# EAGLE design legoPFremote (EAGLE 8.3.2)
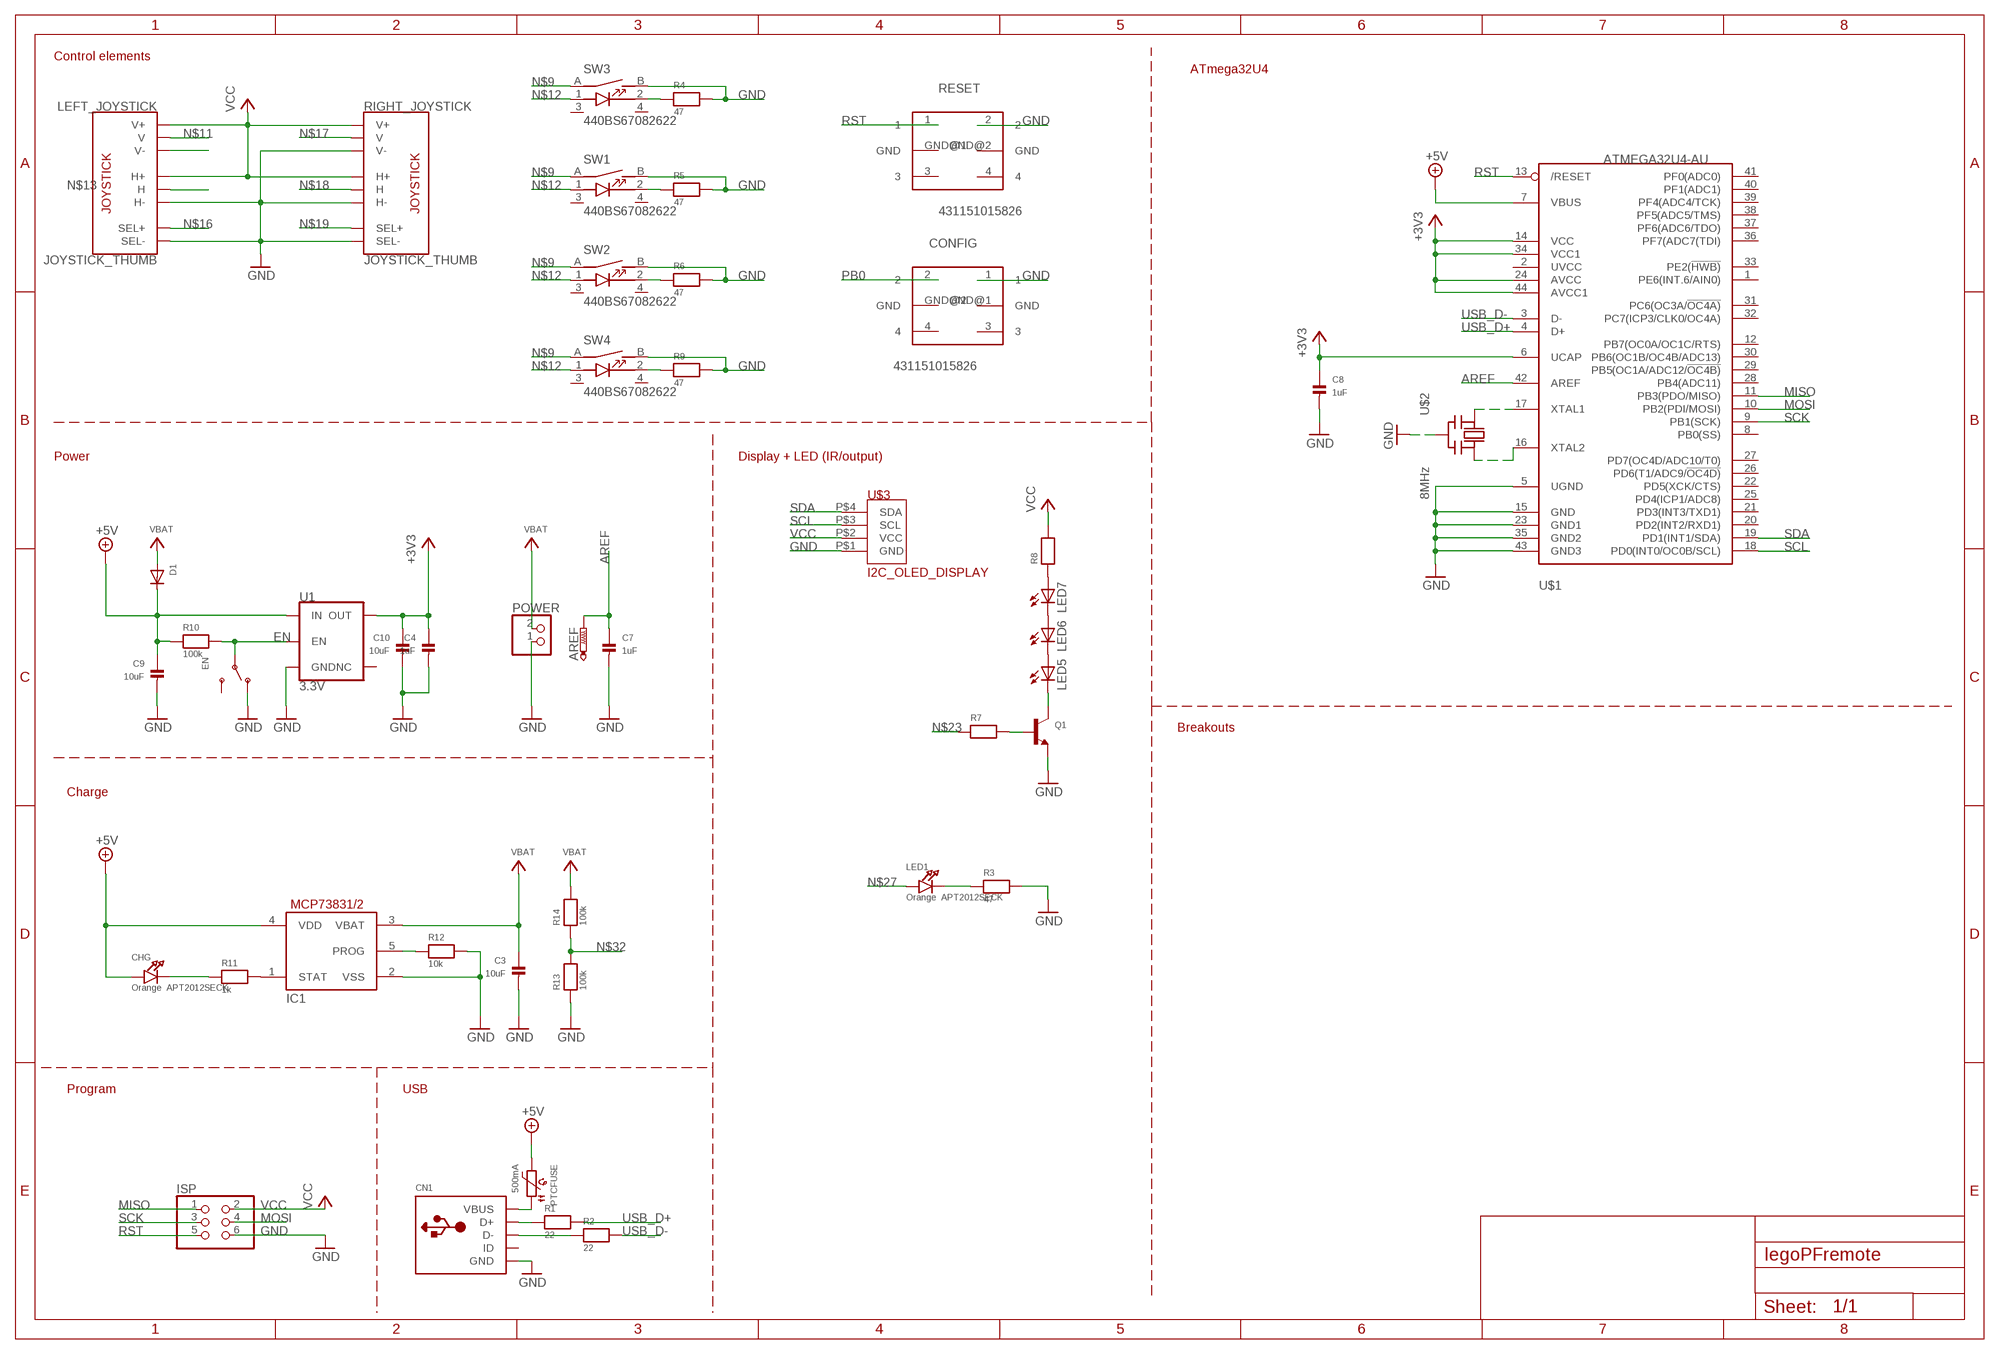
[diagram p0: schematic, sheet 1]

## Parts
AREF  PTR1B1,27  [B1,27]
C3  10uF  CAP_CERAMIC0805  [0805]
C4  1uF  CAP_CERAMIC0805  [0805]
C7  1uF  CAP_CERAMIC0805  [0805]
C8  1uF  CAP_CERAMIC0805  [0805]
C9  10uF  CAP_CERAMIC0805  [0805]
C10  10uF  CAP_CERAMIC0805  [0805]
CHG  Orange APT2012SECK  LED0805  [CHIPLED_0805]
CN1  USBMINIB  [USB-MINIB]
CONFIG  431151015826  [431181015816]
D1  DIODESOD-123  [SOD-123]
EN  SWITCH_SPDT  [SPDT_SMT_SSSS811101]
IC1  MCP73831/OT  [SOT23-5L]
ISP  PINHD-2X3  [2X03]
LED1  Orange APT2012SECK  LED0805  [CHIPLED_0805]
LED5  LEDIRL80A  [IRL80A]
LED6  LEDIRL80A  [IRL80A]
LED7  LEDIRL80A  [IRL80A]
LEFT_JOYSTICK  JOYSTICK_THUMB  [JOYSTICK]
POWER  JST_2PIN-THM  [JST-PH-2-THM]
PTCFUSE  500mA  PTC1206  [1206]
Q1  TRANSISTOR_NPN  [SOT23-R]
R1  22  RESISTOR0805  [0805]
R2  22  RESISTOR0805  [0805]
R3  47  RESISTOR0805  [0805]
R4  47  RESISTOR0805  [0805]
R5  47  RESISTOR0805  [0805]
R6  47  RESISTOR0805  [0805]
R7  RESISTOR0805  [0805]
R8  RESISTOR0805  [0805]
R9  47  RESISTOR0805  [0805]
R10  100k  RESISTOR0805  [0805]
R11  1k  RESISTOR0805  [0805]
R12  10k  RESISTOR0805  [0805]
R13  100k  RESISTOR0805  [0805]
R14  100k  RESISTOR0805  [0805]
RESET  431151015826  [431181015816]
RIGHT_JOYSTICK  JOYSTICK_THUMB  [JOYSTICK]
SW1  440BS67082622  [440BS67082622]
SW2  440BS67082622  [440BS67082622]
SW3  440BS67082622  [440BS67082622]
SW4  440BS67082622  [440BS67082622]
U1  3.3V  V_REG_AP2112K-3.3V  [SOT23-5]
U$1  ATMEGA32U4-AU  [TQFP44]
U$2  8MHz  CERMOSCILL-CSTCRG  [CSTCR-G]
U$3  I2C_OLED_DISPLAY  [HD1X4]

## Nets
+3V3: C4.1 C8.1 C10.1 U1.5(OUT) U$1.6(UCAP) U$1.14(VCC) U$1.24(AVCC) U$1.34(VCC1) U$1.44(AVCC1)
+5V: C9.1 CHG.A D1.C IC1.4(VDD) PTCFUSE.2 R10.1 U1.1(IN) U$1.7(VBUS)
AREF: AREF.TP C7.1 U$1.42(AREF)
EN: EN.B(P) R10.2 U1.3(EN)
GND: C3.2 C4.2 C7.2 C8.2 C9.2 C10.2 CN1.GND CONFIG.1 EN.A(O) IC1.2(VSS) ISP.6 LEFT_JOYSTICK.B2A(SEL-) LEFT_JOYSTICK.H3(H-) POWER.1 Q1.2(E) R3.2 R4.2 R5.2 R6.2 R9.2 R12.2 R13.1 RESET.2 RIGHT_JOYSTICK.B2A(SEL-) RIGHT_JOYSTICK.H3(H-) RIGHT_JOYSTICK.V3(V-) SW1.B SW2.B SW3.B SW4.B U1.2(GND) U$1.5(UGND) U$1.15(GND) U$1.23(GND1) U$1.35(GND2) U$1.43(GND3) U$2.2(GND) U$3.P$1(GND)
MISO: ISP.1 U$1.11(PB3(PDO/MISO))
MOSI: ISP.4 U$1.10(PB2(PDI/MOSI))
N$1: CN1.D+ R1.1
N$2: CN1.D- R2.1
N$3: LED5.A LED6.K(C)
N$4: LED6.A LED7.K(C)
N$5: CN1.VBUS PTCFUSE.1
N$6: U$1.16(XTAL2) U$2.3(OUT)
N$7: U$1.17(XTAL1) U$2.1(IN)
N$8: LED1.C R3.1
N$9: SW1.A SW2.A SW3.A SW4.A
N$10: R4.1 SW3.2
N$11: LEFT_JOYSTICK.V2(V)
N$12: SW1.1 SW2.1 SW3.1 SW4.1
N$13: LEFT_JOYSTICK.H2(H)
N$14: R5.1 SW1.2
N$15: R6.1 SW2.2
N$16: LEFT_JOYSTICK.B1A(SEL+)
N$17: RIGHT_JOYSTICK.V2(V)
N$18: RIGHT_JOYSTICK.H2(H)
N$19: RIGHT_JOYSTICK.B1A(SEL+)
N$20: Q1.1(B) R7.2
N$21: LED7.A R8.1
N$22: LEFT_JOYSTICK.V3(V-)
N$23: R7.1
N$24: LED5.K(C) Q1.3(C)
N$25: R9.1 SW4.2
N$26: IC1.1(STAT) R11.2
N$27: LED1.A
N$28: CHG.C R11.1
N$30: IC1.5(PROG) R12.1
N$32: R13.2 R14.1
PB0: CONFIG.2
RST: ISP.5 RESET.1 U$1.13(/RESET)
SCK: ISP.3 U$1.9(PB1(SCK))
SCL: U$1.18(PD0(INT0/OC0B/SCL)) U$3.P$3(SCL)
SDA: U$1.19(PD1(INT1/SDA)) U$3.P$4(SDA)
USB_D+: R1.2 U$1.4(D+)
USB_D-: R2.2 U$1.3(D-)
VBAT: C3.1 D1.A IC1.3(VBAT) POWER.2 R14.2
VCC: ISP.2 LEFT_JOYSTICK.H1(H+) LEFT_JOYSTICK.V1(V+) R8.2 RIGHT_JOYSTICK.H1(H+) RIGHT_JOYSTICK.V1(V+) U$3.P$2(VCC)
Unconnected: CN1.ID CONFIG.3 CONFIG.4 CONFIG.GND@1(GND) CONFIG.GND@2(GND) EN.C(S) RESET.3 RESET.4 RESET.GND@1(GND) RESET.GND@2(GND) SW1.3 SW1.4 SW2.3 SW2.4 SW3.3 SW3.4 SW4.3 SW4.4 U1.4(NC) U$1.1(PE6(INT.6/AIN0)) U$1.2(UVCC) U$1.8(PB0(SS)) U$1.12(PB7(OC0A/OC1C/RTS)) U$1.20(PD2(INT2/RXD1)) U$1.21(PD3(INT3/TXD1)) U$1.22(PD5(XCK/CTS)) U$1.25(PD4(ICP1/ADC8)) U$1.26(PD6(T1/ADC9/!OC4D)) U$1.27(PD7(OC4D/ADC10/T0)) U$1.28(PB4(ADC11)) U$1.29(PB5(OC1A/ADC12/!OC4B)) U$1.30(PB6(OC1B/OC4B/ADC13)) U$1.31(PC6(OC3A/!OC4A)) U$1.32(PC7(ICP3/CLK0/OC4A)) U$1.33(PE2(!HWB)) U$1.36(PF7(ADC7(TDI)) U$1.37(PF6(ADC6/TDO)) U$1.38(PF5(ADC5/TMS)) U$1.39(PF4(ADC4/TCK)) U$1.40(PF1(ADC1)) U$1.41(PF0(ADC0))

## Notes on the sheet
- Control elements
- ATmega32U4
- Power | Display + LED (IR/output)
- Breakouts
- Charge
- Program | USB

## Library data of the parts
AREF = testpad:PTR1: TEST PIN
C3 C4 C7-C10 = microbuilder:CAP_CERAMIC: Ceramic Capacitors 0402 - 0402 Surface Mount Capacitors 16pF 50V 5% [Digikey: 445-4899-2-ND] 18pF 50V 5% [Digikey: 490-1281-2-ND] 22pF 50V 5% [Digikey: 490-1283-2-ND] 68pF 50V 5% [Digikey: 490-1289-2-ND] 0.1uF 10V 10% [Digikey: 490-1318-2-ND] 1.0uF 6.3V 10% [Digikey: 490-1320-2-ND] 0603 - 0603 Surface Mount Capacitors 16 pF 50V 5% [Digikey: 445-5051-2-ND] 22 pF 50V [Digikey: PCC220ACVTR-ND] 33 pF 50V 5% [Digikey: 490-1415-1-ND] 56pF 50V 5% [Digikey: 490-1421-1-ND] 220pF 50V 5% [Digikey: 445-1285-1-ND] 680 pF 50V 2200 pF 50V 5% C0G [Digikey: 445-1297-1-ND] 5600 pF 100V 5% X7R [Digikey: 478-3711-1-ND] 0.1 µF 25V 10% [Digikey: PCC2277TR-ND] 0.22 µF 16V 10% X7R [Digikey: 445-1318-1-ND] 1.0 µF 25V 10% [Digikey: 445-5146-2-ND] 0603 - RF Specific 3pF 250V +/-0.1pF RF [Digikey: 712-1347-1-ND] 18 pF 250V 5% [Digikey: 478-3505-1-ND or 712-1322-1-ND] 56 pF 250V 5% C0G RF [Digikey: 490-4867-1-ND] 68 pF 250V RF [Digikey: 490-4868-1-ND] 0805 - 0805 Surface Mount Capacitors 220 pF 250V 2% RF Ceramic Capacitor [Digikey: 712-1398-1-ND] 1000 pF 50V 2% NP0 Ceramic Capacitor [Digikey: 478-3760-1-ND] 0.1 µF 25V 10% Ceramic Capacitor [Digikey: PCC1828TR-ND] 1.0 µF 16V 10% Ceramic Capacitor[Digikey: 490-1691-2-ND] 10.0 µF 10V 10% Ceramic Capacitor[Digikey: 709-1228-1-ND] 10.0 uF 16V 10% Ceramic Capacitor [Digikey: 478-5165-2-ND] 47 uF 6.3V 20% Ceramic Capacitor [Digikey: 587-1779-1-ND or 399-5506-1-ND] 1206 - 1206 Surface Mount Capacitors 47uF 10V 20% Ceramic Capacitor [Digikey: 490-5528-1-ND or 399-5508-1-ND or 445-6010-1-ND]
CHG LED1 = microbuilder:LED: LED
CN1 = adafruit:USB: USB Connectors USBMINIB - Surface Mount Female Mini-B USB Connector 4UConnector: 06564 By microbuilder.eu Thru-hole RA Female Mini-B USB Connector 4UConnector: 18732 By ladyada.net
CONFIG RESET = Wurth_Elektronik_Electromechanic_Switchs_rev15b:431151015826: WS-TSS-5x5 mm SMD Tact Switch with ground terminal, 4 pins
D1 = adafruit:DIODE: Diode SMADIODE - SMA Surface Mount Package 20V 1A Schottky Diode Digikey: 641-1014-6-ND DO-1N4148 - Through Hole Small Current Diode SOD-123 20V 1 A (.5mV Vf) Schottky Diode - Digikey: MBRX120TPMSCT-ND SOD-323 10V 570mA (.38mV Vf, 3ns) Schottky Diode - Digikey: ZLLS410CT-ND SOD-523 30V 30mA Schottky Diode (RB751S-40TE61) - Digikey: RB751S-40TE61CT-ND SOT23-R/W - SOT23 Package (R = Solder Paste/Reflow Ovens, W = Hand-Soldering) BAT54Film 40V 300mA - Digikey: 497-7162-1-ND
EN = microbuilder:SWITCH_SPDT: Switch - SPDT SSSS811101 - Horizontal Two Position SMT, 0.3A 4V [Mouser: 688-SSSS811101]
IC1 = adafruit:MCP73831: MCP73831/2 Miniature Single-Cell, Fully Integrated Li-Ion, Li-Polymer Charge Management Controllers. Nice and small simple lipoly charge controller, with adjustable current and status output (LED) http://www.ladyada.net/library/pcb/eaglelibrary.html
ISP = pinhead:PINHD-2X3: PIN HEADER
LED5-LED7 = adafruit:LED: LED
LEFT_JOYSTICK RIGHT_JOYSTICK = SparkFun-Switches:JOYSTICK_THUMB: Analog Thumb Joystick This is a joystick very similar to the ‘analog’ joysticks on PS2 (PlayStation 2) controllers. Directional movements are simply two potentiometers - one for each axis. Pots are ~10k each. This joystick also has a select button that is actuated when the joystick is pressed down. SparkFun Products Thumb Joystick <https://www.sparkfun.com/products/9032> (COM-09032) SparkFun Thumb Joystick Breakout <https://www.sparkfun.com/products/9110> (BOB-09110) SparkFun Joystick Shield Kit <https://www.sparkfun.com/products/9760> (DEV-09760); PROD_ID: COMP-09744; SF_SKU: COM-09032
POWER = adafruit:JST_2PIN: JST 2-Pin Connectors of various flavors SMT-RA (S2B-PH-SM4) 4UConnector #17311 SMT (B2B-PH-SM4) THM-RA (S2B-PH) THM (B2B-PH)
PTCFUSE = microbuilder:PTC: PTC (Resettable Fuse) 1206 Package 250mA PTC (16V Max, Time-to-Trip: 0.08s) - Digikey: F2110CT-ND 1210 Package 100mA PTC (30V Max, Time-to-Trip: 0.6s) - Digikey: MF-USMF010-2CT-ND 1812 Package 750mA PTC (24V Max, Time-to-Trip: 0.2s) - Digikey: MF-MSMF075/24-2CT-ND
Q1 = microbuilder:TRANSISTOR_NPN: NPN Transistor Transistor (NPN) 500mA 45V - BC817 [Digikey: 568-1631-1-ND] Transistor (NPN) 500mA 45V - BC817,215 [Mouser: 771-BC817-T/R] SOT23-R - SOT23 footprint optimised for use with solder paste and reflow ovens. SOT23-W - SOT23 footprint optimised for hand-soldering (larger pads).
R1-R14 = microbuilder:RESISTOR: Resistors 0402 - 0402 Surface Mount Package 22 Ohm 1% 1/16W [Digikey: 311-22.0LRTR-ND] 33 Ohm 5% 1/16W 1.0K 5% 1/16W 1.5K 5% 1/16W 2.0K 1% 1/16W 10.0K 1% 1/16W [Digikey: 311-10.0KLRTR-ND] 10.0K 5% 1/16W [Digikey: RMCF0402JT10K0TR-ND] 12.1K 1% 1/16W [Digikey: 311-22.0LRTR-ND] 100.0K 5% 1/16W 0603 - 0603 Surface Mount Package 0 Ohm 1/10 Watt 1% Resistor 15 Ohm 1/10 Watt 1% Resistor 33 Ohm 1/10 Watt 1% Resistor 49.9 Ohm 1/10 Watt 1% Resistor 100 Ohm 1/10 Watt 1% Resistor 150 Ohm 1/10 Watt 1% Resistor 240 Ohm 1/10 Watt 1% Resistor 390 Ohm 1/10 Watt 1% Resistor 560 Ohm 1/10 Watt 1% Resistor 680 Ohm 1/10 Watt 1% Resistor 750 Ohm 1/10 Watt 1% Resistor 1.0K Ohm 1/10 Watt 1% Resistor 1.5K Ohm 1/10 Watt 1% Resistor 2.0K Ohm 1/10 Watt 1% Resistor 2.2K Ohm 1/10 Watt 1% Resistor 3.3K Ohm 1/10 Watt 1% Resistor 4.7K Ohm 1/10 Watt 1% Resistor 10.0K Ohm 1/10 Watt 1% Resistor 12.0K Ohm 1/10 Watt 1% Resistor 12.1K Ohm 1/10 Watt 1% Resistor 20.0K Ohm 1/10 Watt 1% Resistor 33.0K Ohm 1/10 Watt 1% Resistor 100.0K Ohm 1/10 Watt 1% Resistor 0805 - 0805 Surface Mount Package 0 Ohm 1/8 Watt 1% Resistor 33 Ohm 1/8 Watt 1% Resistor 100 Ohm 1/8 Watt 1% Resistor 150 Ohm 1/8 Watt 1% Resistor 200 Ohm 1/8 Watt 1% Resistor 240 Ohm 1/8 Watt 1% Resistor 330 Ohm 1/8 Watt 1% Resistor 390 Ohm 1/8 Watt 1% Resistor 470 Ohm 1/8 Watt 1% Resistor 1.0K Ohm 1/8 Watt 1% Resistor 1.5K Ohm 1/8 Watt 1% Resistor 2.0K Ohm 1/8 Watt 1% Resistor 4.7K Ohm 1/8 Watt 1% Resistor 5.1K Ohm 1/8 Watt 1% Resistor 5.6K Ohm 1/8 Watt 1% Resistor 10.0K Ohm 1/8 Watt 1% Resistor 22.0K Ohm 1/8 Watt 1% Resistor 33.0K Ohm 1/8 Watt 1% Resistor 100K Ohm 1/8 Watt 1% Resistor 1206 - 1206 Surface Mount Package 2012 - 2010 Surface Mount Package 0.11 Ohm 1/2 Watt 1% Resistor - Digikey: RHM.11UCT-ND
SW1-SW4 = Wurth_Elektronik_Electromechanic_Switchs_rev15b:440BS67082622: WS-TLT 12x12mm Tact Switch with integrated LED, THT version, 6 pins
U1 = SparkFun-IC-Power:V_REG_AP2112: AP2112 - 600mA CMOS LDO Regulator w/ Enable The AP2112 is CMOS process low dropout linear regulator with enable function, the regulator delivers a guaranteed 600mA (min.) continuous load current. Features Output Voltage Accuracy: ±1.5% Output Current: 600mA (Min.) Foldback Short Current Protection: 50mA Enable Function to Turn ON/OFF VOUT Low Dropout Voltage (3.3V): 250mV (Typ.) @IOUT=600mA Excellent Load Regulation: 0.2%/A (Typ.) Excellent Line Regulation: 0.02%/V (Typ.) Low Quiescent Current: 55μA (Typ.) Low Standby Current: 0.01μA (Typ.) Low Output Noise: 50μVRMS PSRR: 100Hz -65dB, 1kHz -65dB OTSD Protection Stable with 1.0μF Flexible Cap: Ceramic, Tantalum and Aluminum Electrolytic Operation Temperature Range: -40°C to 85°C ESD: MM 400V, HBM 4000V; PROD_ID: VREG-12457
U$1 = adafruit:ATMEGA32U4: http://www.ladyada.net/library/eagle
U$2 = adafruit:CERMOSCILL: Ceramic oscillator with built in capacitors such as ZTT-12MHz http://www.ladyada.net/library/eagle
U$3 = an-erd:I2C_OLED_DISPLAY

## Board
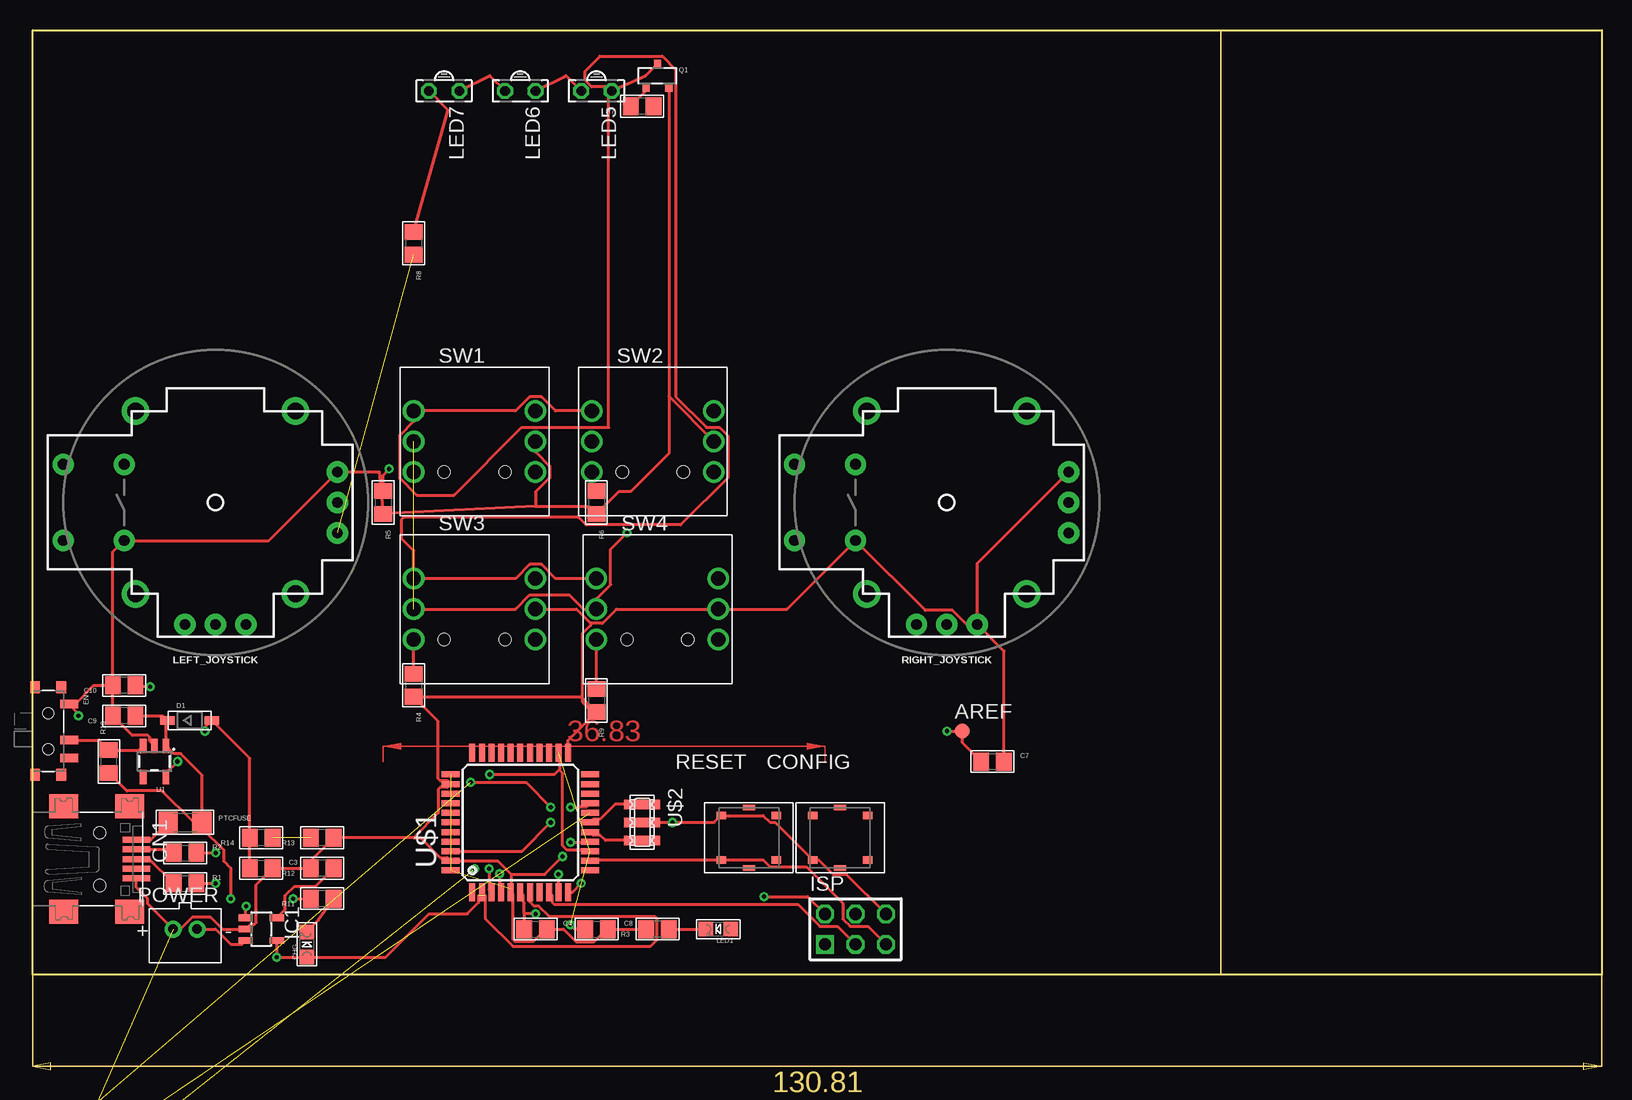
[diagram p1: board, top side]
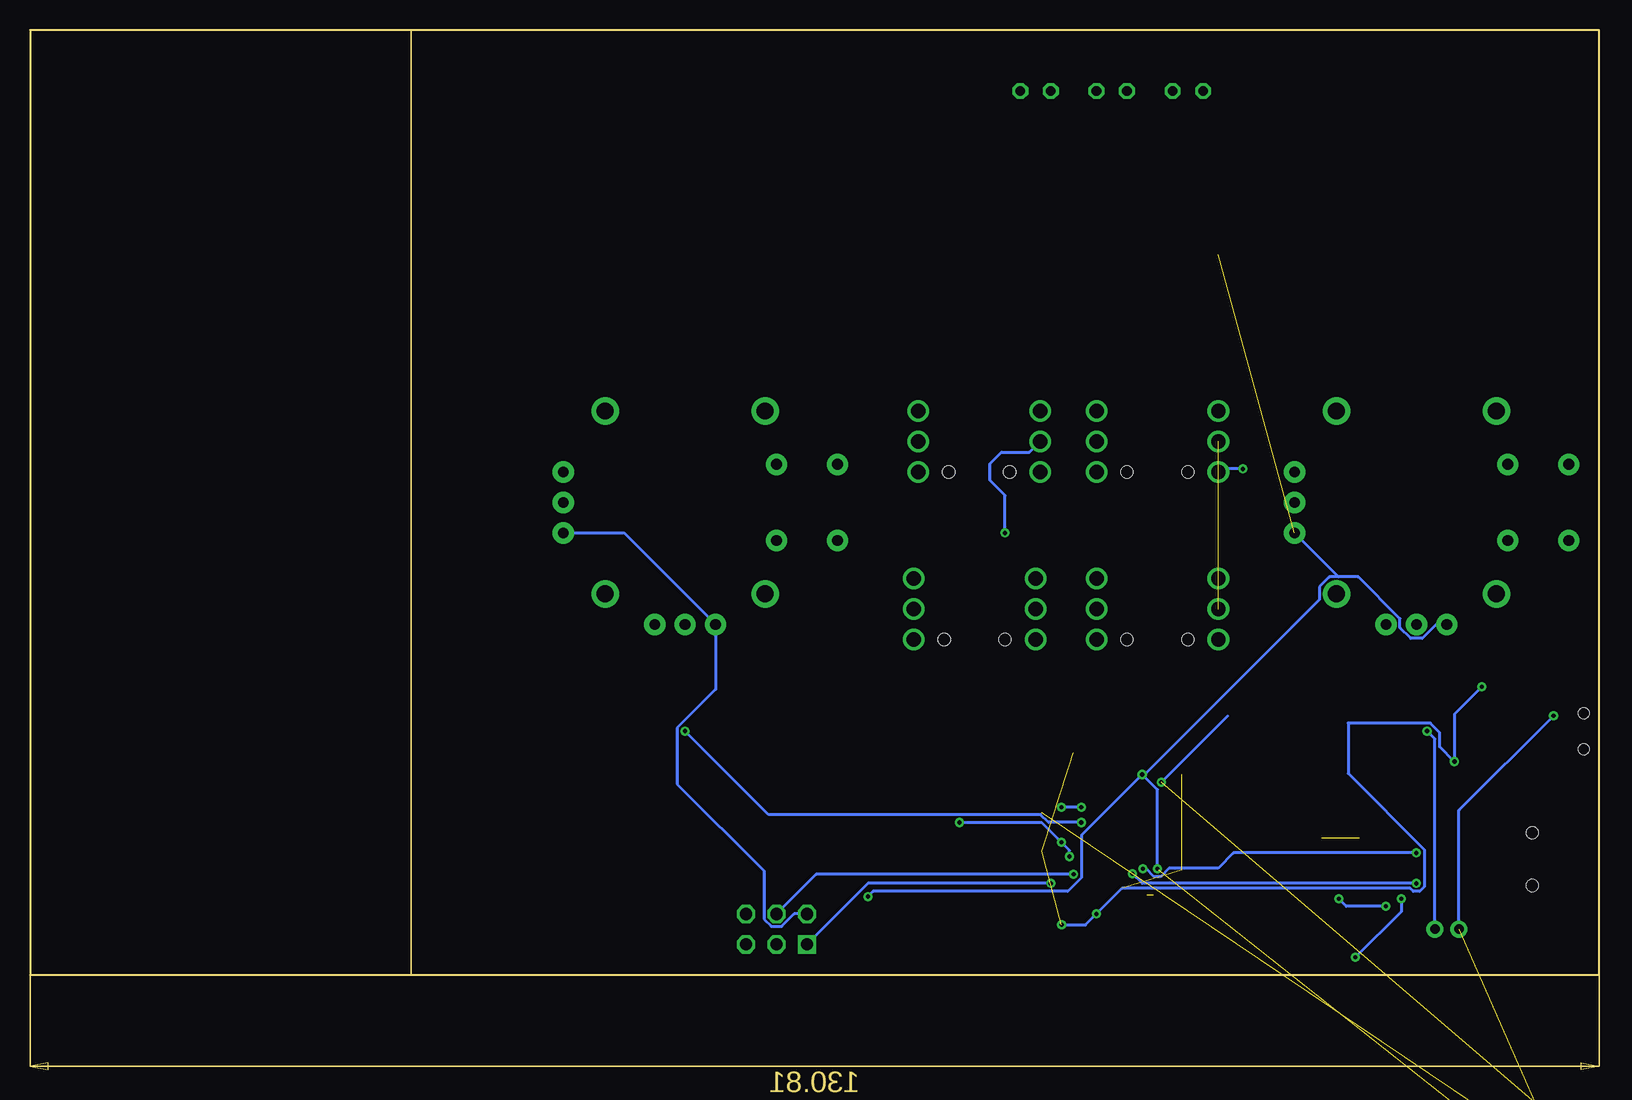
[diagram p2: board, bottom side, seen from below]

Size 130.81 x 78.74 mm. Coordinates in mm from the lower left corner, seen from the top.
Outline: 0,0 0,78.74 130.81,78.74 130.81,0 0,0
Copper layers (1*16): Top 0.035mm / dielectric 1.5mm / Bottom 0.035mm
Design rules "default": minimum track width 6mil, minimum drill 0.35mm, track to track 6mil, track to pad 6mil, pad to pad 6mil, via to via 6mil, smd to smd 6mil, copper to edge 40mil, drill to drill 6mil, minimum pad ring 10mil, minimum via ring 8mil, stop-mask expansion 4mil, vias tented up to drill 0mil, thermal gap 10mil

### Footprints (pad centres in the part's own frame; a part is rotated, then mirrored left to right if it is on the bottom)
B1,27 = smd 1.27 x 1.27: TP 0,0
0805 = smd 1.3 x 1.5: 1 -0.95,0; 2 0.95,0
CHIPLED_0805 = smd 1.2 x 1.2: A 0,-1.05; C 0,1.05
USB-MINIB = smd 0.5 x 2.308: D+ 0,4.064; D- -0.8,4.064; GND 1.6,4.064; ID 0.8,4.064; VBUS -1.6,4.064 | smd 2 x 2.4: GND1 -4.4,-2; GND2 -4.4,3.5; GND3 4.4,3.5; GND4 4.4,-2 | hole 1: -2.2,1; 2.2,1
431181015816 = smd 0.8 x 0.6: 1 -2.3,-1.85; 2 -2.3,1.85; 3 2.3,-1.85; 4 2.3,1.85 | smd 1 x 0.45: GND@1 0,-2.525; GND@2 0,2.525
SOD-123 = smd 1.2 x 0.7: A 1.85,0; C -1.85,0
SPDT_SMT_SSSS811101 = smd 0.7 x 1.5: A -2.25,1.75; B 0.75,1.75; C 2.25,1.75 | smd 1 x 0.8: SUP1 -3.65,1.1; SUP2 -3.65,-1.1; SUP3 3.65,1.1; SUP4 3.65,-1.1 | hole 0.9: -1.5,0; 1.5,0
SOT23-5L = smd 0.55 x 1.2: 1 -0.95,-1.3; 2 0,-1.3; 3 0.95,-1.3; 4 0.95,1.3; 5 -0.95,1.3
2X03 = drill 1.016 square: 1 -2.54,-1.27 | drill 1.016 octagon: 2 -2.54,1.27; 3 0,-1.27; 4 0,1.27; 5 2.54,-1.27; 6 2.54,1.27
IRL80A = drill 0.813 octagon: A 0,-1.27; K 0,1.27
JOYSTICK = drill 0.9 pad 1.778: B1A -3.175,12.7; B1B 3.175,12.7; B2A -3.175,7.62; B2B 3.175,7.62 | drill 0.889 pad 1.778: H1 -2.54,-10.16; H2 0,-10.16; H3 2.54,-10.16; V1 -10.16,2.54; V2 -10.16,0; V3 -10.16,-2.54 | drill 1.397 pad 2.286: MOUNT1 -7.62,6.668; MOUNT2 -7.62,-6.668; MOUNT3 7.62,-6.668; MOUNT4 7.62,6.668
JST-PH-2-THM = drill 0.8 pad 1.422: 1 1,0; 2 -1,0
1206 = smd 1.6 x 1.8: 1 -1.4,0; 2 1.4,0
SOT23-R = smd 0.6 x 0.7: 1 -0.95,-1; 2 0.95,-1; 3 0,1
440BS67082622 = drill 1.2: 1 -5.08,2.54; 2 -5.08,-2.54; 3 5.08,-2.54; 4 5.08,2.54; A -5.08,0; B 5.08,0 | hole 1: -2.54,-2.54; 2.54,-2.54
SOT23-5 = smd 0.55 x 1.2: 1 -0.95,-1.3; 2 0,-1.3; 3 0.95,-1.3; 4 0.95,1.3; 5 -0.95,1.3
TQFP44 = smd 1.5 x 0.5: 1 -5.8,4; 2 -5.8,3.2; 3 -5.8,2.4; 4 -5.8,1.6; 5 -5.8,0.8; 6 -5.8,0; 7 -5.8,-0.8; 8 -5.8,-1.6; 9 -5.8,-2.4; 10 -5.8,-3.2; 11 -5.8,-4; 23 5.8,-4; 24 5.8,-3.2; 25 5.8,-2.4; 26 5.8,-1.6; 27 5.8,-0.8; 28 5.8,0; 29 5.8,0.8; 30 5.8,1.6; 31 5.8,2.4; 32 5.8,3.2; 33 5.8,4 | smd 0.5 x 1.5: 12 -4,-5.8; 13 -3.2,-5.8; 14 -2.4,-5.8; 15 -1.6,-5.8; 16 -0.8,-5.8; 17 0,-5.8; 18 0.8,-5.8; 19 1.6,-5.8; 20 2.4,-5.8; 21 3.2,-5.8; 22 4,-5.8; 34 4,5.8; 35 3.2,5.8; 36 2.4,5.8; 37 1.6,5.8; 38 0.8,5.8; 39 0,5.8; 40 -0.8,5.8; 41 -1.6,5.8; 42 -2.4,5.8; 43 -3.2,5.8; 44 -4,5.8
CSTCR-G = smd 0.8 x 3: 1 -1.5,0; 2 0,0; 3 1.5,0
HD1X4 = drill 0.6: P$1 0,0; P$2 0,2.54; P$3 0,5.08; P$4 0,7.62

### Placement (x,y rotation side)
AREF  77.47,20.32 0 top
C3  19.05,8.89 0 top
C4  41.91,3.81 0 top
C7  80.01,17.78 0 top
C8  46.99,3.81 0 top
C9  7.62,21.59 180 top
C10  7.62,24.13 180 top
CHG  22.86,2.54 0 top
CN1  4.57,9.65 270 top
CONFIG  67.31,11.43 0 top
D1  13.08,21.21 0 top
EN  1.27,20.32 270 top
IC1  19.05,3.81 270 top
ISP  68.58,3.81 0 top
LED1  57.15,3.81 90 top
LED5  46.99,73.66 270 top
LED6  40.64,73.66 270 top
LED7  34.29,73.66 270 top
LEFT_JOYSTICK  15.24,39.37 90 top
POWER  12.7,3.81 180 top
PTCFUSE  12.7,12.7 0 top
Q1  52.07,74.93 0 top
R1  12.7,7.62 0 top
R2  12.7,10.16 0 top
R3  52.07,3.81 180 top
R4  31.75,24.13 270 top
R5  29.21,39.37 270 top
R6  46.99,39.37 270 top
R7  50.8,72.39 180 top
R8  31.75,60.96 270 top
R9  46.99,22.86 270 top
R10  6.35,17.78 90 top
R11  24.13,6.35 180 top
R12  24.13,8.89 180 top
R13  24.13,11.43 180 top
R14  19.05,11.43 180 top
RESET  59.69,11.43 0 top
RIGHT_JOYSTICK  76.2,39.37 90 top
SW1  36.83,44.45 0 top
SW2  51.69,44.45 0 top
SW3  36.83,30.48 0 top
SW4  52.07,30.48 0 top
U1  10.16,17.78 180 top
U$1  40.64,12.7 90 top
U$2  50.8,12.7 270 top
U$3  0,-22.86 0 top  (outside the outline)

### Tracks (layer width: path | path; a pad name or v marks a point on that pad's centre or on a via)
+3V3  (via drill 0.35)  (4 unrouted)
  Top 0.254: U1.5 11.11,16.82 v12.06,17.78 | v9.78,24 8.7,24 C10.1 | 40.96,5.08 C4.1 | 40.96,5.08 40.96,5.99 40.91,6.03 40.91,6.63 U$1.6 | v41.91,5.08 40.96,5.08 | C8.1 45.17,3.81 v44.81,4.17
  Bottom 0.254: v9.78,24 12.06,21.72 v12.06,17.78 13.29,19.01 13.29,20.19 14.08,20.98 20.93,20.98 20.93,16.78 14.58,10.43 14.58,7.35 14.97,6.96 15.51,6.96 15.76,7.21 39.78,7.21 v41.91,5.08 42.82,4.17 v44.81,4.17
+5V  (via drill 0.35)  (1 unrouted)
  Top 0.254: C9.1 10.85,21.59 D1.C 11.11,21.09 U1.1 11.75,18.44 12.34,18.44 14.1,16.68 PTCFUSE.2 | R10.1 7.85,15.33 10.76,15.33 13.39,12.7 PTCFUSE.2 | PTCFUSE.2 14.1,12.23 15.9,10.43 15.9,9.5 16.51,8.89 v16.51,6.35 | IC1.4 20.32,2.83 v20.32,1.47 22.84,1.47 CHG.A 29.43,1.49 33.02,5.08 36.22,5.08 37.17,6.03 37.17,6.63 | U$1.7 41.44,6.08 41.78,5.74 42.18,5.74 43.08,4.84 51.89,4.84 52.05,4.68 52.05,2.94 51.48,2.37 40.03,2.37 37.71,4.69 37.71,6.63
  Bottom 0.254: v16.51,6.35 16.51,5.28 v20.32,1.47
AREF  (via drill 0.35)
  Top 0.254: U$1.42 40.78,10.3 v43.18,12.7 | v76.2,20.32 AREF.TP 77.47,19.37 C7.1
  Bottom 0.254: v43.18,12.7 45.91,12.7 46.56,13.36 69.24,13.36 v76.2,20.32
EN
  Top 0.254: EN.B 5.51,19.57 R10.2 8.86,18.73 U1.3
GND  (via drill 0.35)  (1 unrouted)
  Top 0.254: C10.2 5.08,24.13 3.52,22.57 EN.A 3.81,21.78 v3.81,21.59 | U1.2 9.76,19.48 9.76,19.8 9.6,19.96 8.3,19.96 C9.2 C10.2 | 31.75,11.43 R13.1 23.18,9.53 R12.2 C3.2 18.63,7.52 18.63,4.37 18.47,4.21 18.15,4.21 IC1.2 15.81,3.81 14.82,4.8 13.29,4.8 12.3,3.81 POWER.1 9.55,5.96 9.55,6.37 8.64,7.28 CN1.GND | 31.75,11.43 32.31,11.43 33.97,9.77 34.57,9.77 U$1.43 38.76,9.5 39.88,8.38 | U$2.2 v53.34,12.7 56.81,12.7 RESET.2 60.9,13.28 61.47,12.7 61.89,12.7 CONFIG.1 65.52,9.58 66.69,8.4 67.8,8.4 ISP.6 | v44.83,11.05 46.39,11.05 U$1.15 | C8.2 47.84,3.81 46.81,2.78 45.27,2.78 44.24,3.81 C4.2 42.76,3.81 41.73,2.78 40.19,2.78 40.03,2.94 40.03,6.71 U$1.5 39.88,6.94 39.88,8.38 | 48.26,3.81 C8.2 | C8.2 R3.2 | 39.88,8.38 42.67,8.38 v44.16,9.87 | 31.75,11.43 33.81,13.49 33.81,15.47 33.97,15.63 34.57,15.63 U$1.35 34.57,16.17 33.97,16.17 33.81,16.33 33.81,21.12 R4.2 45.72,23.18 R9.2 46.83,21.75 | U$1.23 44.64,19.56 46.83,21.75 | C7.2 80.96,26.99 RIGHT_JOYSTICK.V3 | RIGHT_JOYSTICK.V3 77.85,29.21 76.68,30.38 74.4,30.38 RIGHT_JOYSTICK.B2A 62.87,30.48 SW4.B 48.66,30.48 47.48,29.3 46.5,29.3 | RIGHT_JOYSTICK.V3 78.74,34.29 RIGHT_JOYSTICK.H3 | C10.2 6.67,35.24 LEFT_JOYSTICK.B2A 19.68,36.2 LEFT_JOYSTICK.H3 28.89,41.91 R5.2 41.91,39.05 | 41.91,39.05 46.36,39.05 R6.2 48.84,40.27 49.83,40.27 53.02,43.46 53.02,48.2 | Q1.2 53.02,48.2 | 53.02,48.2 SW2.B | SW1.B 41.91,43.58 43.09,42.4 43.09,41.42 41.91,40.24 41.91,39.05 | SW3.B 45.32,30.48 46.5,29.3 | 46.5,29.3 46.5,29.12 45.81,28.43 45.81,22.77 46.83,21.75
  Bottom 0.254: POWER.1 11.7,13.7 v3.81,21.59 | v53.34,12.7 46.48,12.7 v44.83,11.05 44.16,10.37 v44.16,9.87
MISO  (via drill 0.35)
  Top 0.254: U$1.11 45,6.9 v45.72,7.62
  Bottom 0.254: v45.72,7.62 60.96,7.62 ISP.1
MOSI  (via drill 0.35)
  Top 0.254: U$1.10 43.84,8.36 v43.81,8.38
  Bottom 0.254: v43.81,8.38 65.28,8.38 ISP.4
N$1
  Top 0.254: CN1.D+ 9.72,9.65 R1.1
N$2
  Top 0.254: CN1.D- 11.46,10.45 R2.1
N$3
  Top 0.254: LED6.K 44.45,74.93 LED5.A
N$4
  Top 0.254: LED7.K 38.1,74.93 LED6.A
N$5
  Top 0.254: CN1.VBUS 9.85,11.25 PTCFUSE.1
N$6
  Top 0.254: U$1.16 46.71,11.63 47.31,11.63 47.73,11.2 U$2.3
N$7
  Top 0.254: U$1.17 46.71,12.97 47.31,12.97 48.53,14.2 U$2.1
N$8
  Top 0.254: R3.1 LED1.C
N$9  (via drill 0.35)  (1 unrouted)
  Top 0.254: v49.53,36.83 48.17,35.47 48.17,32.53 46.99,31.35 SW4.A 45.9,30.48 44.72,31.66 41.42,31.66 40.24,30.48 SW3.A
  Bottom 0.254: v49.53,36.83 49.53,39.97 50.79,41.23 50.79,42.59 49.83,43.55 47.51,43.55 SW2.A
N$10
  Top 0.254: R4.1 SW3.2
N$12
  Top 0.254: SW2.1 43.58,46.99 42.4,48.17 41.42,48.17 40.24,46.99 SW1.1 31.75,46.12 30.57,44.94 30.57,41.42 32.01,39.98 35.12,39.98 40.77,45.63 48.01,45.63 48.01,73.99 46.6,73.99 46.05,74.54 46.05,75.32 47.29,76.56 52.49,76.56 53.6,75.45 53.6,48.19 56.16,45.63 57.26,45.63 57.95,44.94 57.95,41.42 54.02,37.49 46.12,37.49 45.49,38.12 30.93,38.12 30.72,37.92 30.72,36.38 31.75,35.35 SW3.1 40.24,33.02 41.42,34.2 42.4,34.2 43.58,33.02 SW4.1
N$14  (via drill 0.35)
  Top 0.254: R5.1 29.21,41.66 v29.72,42.16
  Bottom 0.254: v29.72,42.16 31.5,42.16 SW1.2
N$15
  Top 0.254: SW2.2 46.61,40.7 R6.1
N$20
  Top 0.254: Q1.1 51.12,73.66 R7.2
N$21
  Top 0.254: R8.1 34.61,72.07 LED7.A
N$24
  Top 0.254: LED5.K 51.07,74.93 Q1.3
N$25
  Top 0.254: R9.1 SW4.2
N$26  (via drill 0.35)
  Top 0.254: IC1.1 17.75,5.68 v17.78,5.71 | v21.72,6.35 R11.2
  Bottom 0.254: v17.78,5.71 21.08,5.71 v21.72,6.35
N$28
  Top 0.254: R11.1 23.81,4.54 CHG.C
N$30
  Top 0.254: R12.1 23.57,7.38 21.82,7.38 21.06,6.62 21.06,5.47 IC1.5
N$32  (1 unrouted)
RST
  Top 0.254: U$1.13 46.52,9.58 RESET.1 60.9,9.58 61.47,9 64.49,9 67.54,5.96 67.54,4.65 68.15,4.04 69.62,4.04 ISP.5
SCK
  Top 0.254: U$1.9 43.31,6.63 43.31,6.03 43.47,5.87 63.78,5.87 65.61,4.04 67.08,4.04 ISP.3
SCL  (1 unrouted)
SDA  (via drill 0.35)  (1 unrouted)
  Top 0.254: v36.51,16.04 41.11,16.04 v43.18,13.97 | v44.83,13.97 45.52,13.97 45.57,14.03 46.17,14.03 U$1.19
  Bottom 0.254: 30.96,21.59 v36.51,16.04 | v43.18,13.97 v44.83,13.97
USB_D+  (via drill 0.35)
  Top 0.254: R1.2 v15.24,7.62 | v38.91,8.43 38.91,7.04 U$1.4
  Bottom 0.254: v38.91,8.43 38.1,7.62 v15.24,7.62
USB_D-  (via drill 0.35)
  Top 0.254: R2.2 v15.24,10.16 | v38.04,8.84 38.04,7.1 U$1.3
  Bottom 0.254: v15.24,10.16 30.48,10.16 31.75,8.89 35.85,8.89 36.56,8.19 37.1,8.19 37.76,8.84 v38.04,8.84
VBAT  (via drill 0.35)
  Top 0.254: v14.35,20.32 14.35,20.63 D1.A 18.1,18.04 R14.2 C3.1 | POWER.2 15.24,3.81 16.51,2.54 17.43,2.54 IC1.3
  Bottom 0.254: POWER.2 13.7,19.67 v14.35,20.32
VCC  (via drill 0.35)  (2 unrouted)
  Top 0.254: v38.1,16.7 43.5,16.7 43.88,17.08 | 43.88,17.08 43.94,17.14 43.94,18.4 | 43.88,17.08 44.17,16.79 44.17,10.78 44.56,10.39 46.35,10.39 | 36.69,8.7 v36.83,8.84 | v60.96,6.53 64.59,6.53 ISP.2
  Bottom 0.254: v36.83,8.84 36.83,15.43 38.01,16.61 | 38.01,16.61 v38.1,16.7 43.16,11.64 43.16,8.11 44.3,6.96 60.53,6.96 v60.96,6.53 | RIGHT_JOYSTICK.H1 81.28,36.83 RIGHT_JOYSTICK.V1 73.66,23.79 76.86,20.59 76.86,15.9 69.62,8.66 69.62,4.65 69.01,4.04 68.15,4.04 67.11,5.08 ISP.2 | 21.74,33.17 LEFT_JOYSTICK.H1 | LEFT_JOYSTICK.V1 13.59,29.21 14.76,28.04 15.72,28.04 16.61,28.93 16.61,29.69 20.09,33.17 21.74,33.17 | 21.74,33.17 22.5,33.17 23.33,32.34 23.33,31.28 38.01,16.61
(copper drawn outside any net)
  shapes: Top area x1